# Altium project ROS_Motor-drive-control-panel.PrjPcb
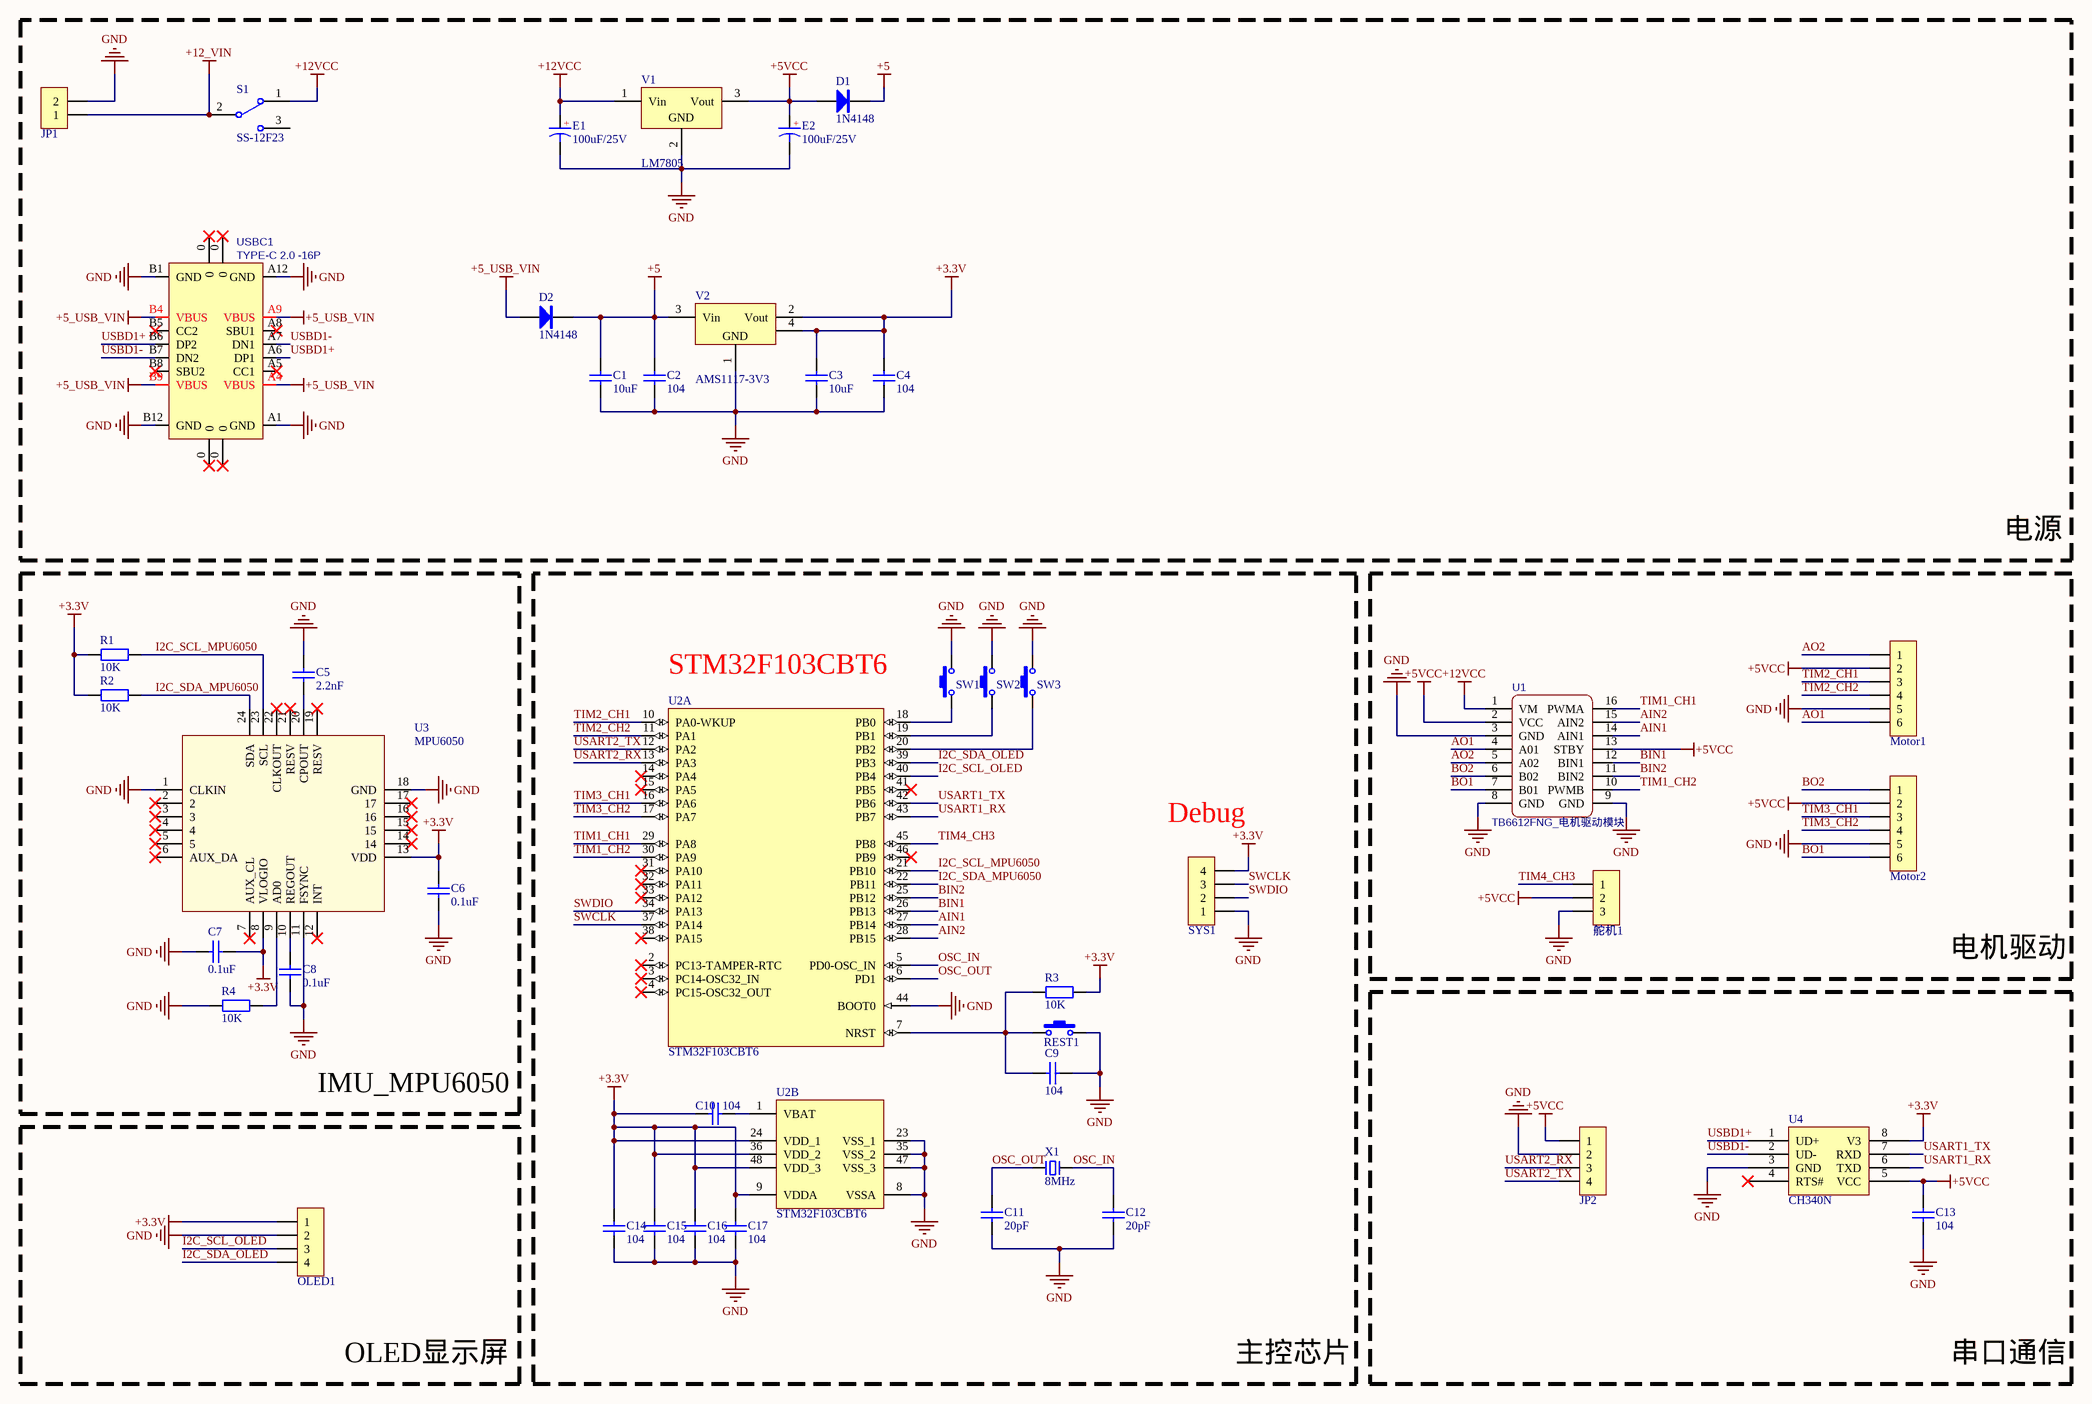
[diagram p0: main.SchDoc]
1 sheet, 45 parts. Net scope: global (net labels, ports and power ports of the same name join across sheets).
Board file: main.PcbDoc

## Sheet main.SchDoc
size A2; SheetNumber: 1; SheetTotal: 1

### Parts
C1  10uF  [C0805_L]
C2  104  [C0805_L]
C3  10uF  [C0805_L]
C4  104  [C0805_L]
C5  2.2nF  [C0805_L]
C6  0.1uF  [C0805_L]
C7  0.1uF  [C0805_L]
C8  0.1uF  [C0805_L]
C9  104  [C0805_L]
C10  104  [C0805_L]
C11  20pF  [C0805_L]
C12  20pF  [C0805_L]
C13  104  [C0805_L]
C14  104  [C0805_L]
C15  104  [C0805_L]
C16  104  [C0805_L]
C17  104  [C0805_L]
D1  1N4148  [MINI_MELF (LL34)]
D2  1N4148  [MINI_MELF (LL34)]
E1  100uF/25V  [CE D(6.3*7.7)]
E2  100uF/25V  [CE D(6.3*7.7)]
JP1  HDR-1X2  [KF350-2P]  (value not drawn)
JP2  HDR-1X4  [HDR2.54-LI-4P]  (value not drawn)
Motor1  HDR-1X6  [XH2.54-LI-6P]  (value not drawn)
Motor2  HDR-1X6  [XH2.54-LI-6P]  (value not drawn)
OLED1  HDR-1X4  [OLED-IIC-096]  (value not drawn)
R1  10K  [R0805_L]
R2  10K  [R0805_L]
R3  10K  [R0805_L]
R4  10K  [R0805_L]
REST1  3x6x5  [SW SMD-3*6*2.5]  (value not drawn)
S1  SS-12F23  [SS-12F23]
SW1  3x6x5  [SW SMD-3*6*2.5]  (value not drawn)
SW2  3x6x5  [SW SMD-3*6*2.5]  (value not drawn)
SW3  3x6x5  [SW SMD-3*6*2.5]  (value not drawn)
SYS1  HDR-1X4  [HDR2.54-LI-4P]  (value not drawn)
U1  TB6612FNG_电机驱动模块  [TP6612FNG]
U2  STM32F103CBT6  [STM-LQFP48_N]  (parts A,B of 2)
U3  MPU6050  [QFN24 4x4_M]
U4  CH340N  [SOIC-8]
USBC1  TYPE-C 2.0 -16P  [USB-C-SMD_16P]
V1  LM7805  [TO252]
V2  AMS1117-3V3  [SOT223_L]
X1  8MHz  [XTAL-5032-2P]
舵机1  HDR-1X3  [HDR2.54-LI-3P]  (value not drawn)

### Blocks framed on the sheet
电源: C1-C4 D1 D2 E1 E2 JP1 S1 USBC1 V1 V2
IMU_MPU6050: C5-C8 R1 R2 R4 U3
电机驱动: Motor1 Motor2 U1 舵机1
串口通信: C13 JP2 U4
OLED显示屏: OLED1

### Nets
+3.3V: C3.2 C4.2 C6.2 C7.2 C10.1 C14.2 C15.2 C16.2 C17.2 OLED1.1 R1.2 R2.2 R3.2 SYS1.4 U2.9(VDDA) U2.24(VDD_1) U2.36(VDD_2) U2.48(VDD_3) U3.8(VLOGIO) U3.13(VDD) U4.8(V3) V2.2(Vout) V2.4(GND)
+5: C1.2 C2.2 D1.2(K) D2.2(K) V2.3(Vin)
+5_USB_VIN: D2.1(A) USBC1.A4(VBUS) USBC1.A9(VBUS) USBC1.B4(VBUS) USBC1.B9(VBUS)
+5VCC: C13.2 D1.1(A) E2.1 JP2.1 Motor1.2 Motor2.2 U1.2(VCC) U1.13(STBY) U4.5(VCC) V1.3(Vout) 舵机1.2
+12_VIN: JP1.1 S1.2
+12VCC: E1.1 S1.1 U1.1(VM) V1.1(Vin)
GND: C1.1 C2.1 C3.1 C4.1 C5.2 C6.1 C7.1 C8.1 C9.2 C11.1 C12.1 C13.1 C14.1 C15.1 C16.1 C17.1 E1.2 E2.2 JP1.2 JP2.2 Motor1.5 Motor2.5 OLED1.2 R4.1 REST1.2 SW1.2 SW2.2 SW3.2 SYS1.1 U1.3(GND) U1.8(GND) U1.9(GND) U2.8(VSSA) U2.23(VSS_1) U2.35(VSS_2) U2.44(BOOT0) U2.47(VSS_3) U3.1(CLKIN) U3.11(FSYNC) U3.18(GND) U4.3(GND) USBC1.A1(GND) USBC1.A12(GND) USBC1.B1(GND) USBC1.B12(GND) V1.2(GND) V2.1(GND) 舵机1.3
AIN1: U1.14(AIN1) U2.27(PB14)
AIN2: U1.15(AIN2) U2.28(PB15)
AO1: Motor1.6 U1.4(A01)
AO2: Motor1.1 U1.5(A02)
BIN1: U1.12(BIN1) U2.26(PB13)
BIN2: U1.11(BIN2) U2.25(PB12)
BO1: Motor2.6 U1.7(B01)
BO2: Motor2.1 U1.6(B02)
I2C_SCL_MPU6050: R1.1 U2.21(PB10) U3.23(SCL)
I2C_SCL_OLED: OLED1.3 U2.40(PB4)
I2C_SDA_MPU6050: R2.1 U2.22(PB11) U3.24(SDA)
I2C_SDA_OLED: OLED1.4 U2.39(PB3)
OSC_IN: C12.2 U2.5(PD0-OSC_IN) X1.2
OSC_OUT: C11.2 U2.6(PD1) X1.1
SWCLK: SYS1.3 U2.37(PA14)
SWDIO: SYS1.2 U2.34(PA13)
TIM1_CH1: U1.16(PWMA) U2.29(PA8)
TIM1_CH2: U1.10(PWMB) U2.30(PA9)
TIM2_CH1: Motor1.3 U2.10(PA0-WKUP)
TIM2_CH2: Motor1.4 U2.11(PA1)
TIM3_CH1: Motor2.3 U2.16(PA6)
TIM3_CH2: Motor2.4 U2.17(PA7)
TIM4_CH3: U2.45(PB8) 舵机1.1
USART1_RX: U2.43(PB7) U4.6(TXD)
USART1_TX: U2.42(PB6) U4.7(RXD)
USART2_RX: JP2.3 U2.13(PA3)
USART2_TX: JP2.4 U2.12(PA2)
USBD1+: U4.1(UD+) USBC1.A6(DP1) USBC1.B6(DP2)
USBD1-: U4.2(UD-) USBC1.A7(DN1) USBC1.B7(DN2)
NetC5_1: C5.1 U3.20(CPOUT)
NetC8_2: C8.2 U3.10(REGOUT)
NetC9_1: C9.1 R3.1 REST1.1 U2.7(NRST)
NetC10_2: C10.2 U2.1(VBAT)
NetR4_2: R4.2 U3.9(AD0)
NetSW1_1: SW1.1 U2.18(PB0)
NetSW2_1: SW2.1 U2.19(PB1)
NetSW3_1: SW3.1 U2.20(PB2)

Not connected (* = marked no-connect by the designer): S1 3; U2 2(PC13-TAMPER-RTC)* 3(PC14-OSC32_IN)* 4(PC15-OSC32_OUT)* 14(PA4)* 15(PA5)* 31(PA10)* 32(PA11)* 33(PA12)* 38(PA15)* 41(PB5)* 46(PB9)*; U3 2* 3* 4* 5* 6(AUX_DA)* 7(AUX_CL)* 12(INT)* 14* 15* 16* 17* 19(RESV)* 21(RESV)* 22(CLKOUT)*; U4 4(RTS#)*; USBC1 0* A5(CC1)* A8(SBU1)* B5(CC2)* B8(SBU2)*

### Notes on the sheet
- (near U2) STM32F103CBT6
- (near SYS1) Debug
- 主控芯片
- (in symbol CE_SMD) +

### Library data of the parts
C1-C17 = C: 贴片电容/MLCC电容; BOM名称: 无极性贴片电容; 联系卖家，免费查找封装: 唯一出售店铺网址https://shop463601444.taobao.com
D1 D2 = 1N4148: 开关二极管; BOM名称: 高速开关二极管; 以赠品形式获赠本封装库的买家，还可联系卖家免费指导AD软件使用: 封装库来自淘宝卖家ID：黄晶宝石
E1 E2 = CE_SMD: 贴片电解电容; 联系卖家，免费查找封装: 唯一出售店铺网址https://shop463601444.taobao.com; BOM名称: 贴片电解电容
JP1 = Header 2: 2P接插件; 联系卖家，免费技术支持: 唯一出售店铺网址https://shop463601444.taobao.com; BOM名称: 2P接插件
JP2 OLED1 SYS1 = Header 4: 4P接插件; 联系卖家，免费查找封装: 唯一出售店铺网址https://shop463601444.taobao.com; 封装库来自淘宝卖家ID:黄晶宝石: 其他店铺购入均为盗版假冒封装库，请立即申请退款，本店现金奖励20~200元; BOM名称: 4P接插件
Motor1 Motor2 = Header 6: 6P接插件; 联系卖家，免费查找封装: 唯一出售店铺网址https://shop463601444.taobao.com; 封装库来自淘宝卖家ID:黄晶宝石: 其他店铺购入均为盗版假冒封装库，请立即申请退款，本店现金奖励20~200元; BOM名称: 6P接插件
R1-R4 = R: 贴片电阻; 联系卖家，免费查找封装: 唯一出售店铺网址https://shop463601444.taobao.com; BOM名称: 贴片电阻
REST1 = SW 3x6: 3x6轻触开关; 联系卖家，免费查找封装: 唯一出售店铺网址https://shop463601444.taobao.com; 封装库来自淘宝卖家ID：黄晶宝石: 其他店铺购入的，请立即申请退款，本店现金奖励20~500元; BOM名称: 3x6轻触开关
S1 = SSW-1P: 1路波动开关; BOM名称: 波动开关; 联系卖家，免费查找封装: 唯一出售店铺网址https://shop463601444.taobao.com; 封装库来自淘宝卖家ID：黄晶宝石: 其他店铺购入的，请立即申请退款，本店现金奖励20~500元
SW1-SW3 = SW-PB: 微动开关; BOM名称: 3x6轻触开关; 联系卖家，免费查找封装: 唯一出售店铺网址https://shop463601444.taobao.com; 封装库来自淘宝卖家ID：黄晶宝石: 其他店铺购入的，请立即申请退款，本店现金奖励20~500元
U1 = TB6612FNG_电机驱动模块: Contributor: TanAifeng; spicePre: U; spiceSymbolName: TB6612FNG_电机驱动模块
U2 = STM32F103CBT6: STM32 ARM-based 32-bit MCU Performance Line with 128 kB Flash, 20 kB Internal RAM, -40 to +85癈 Temperature, 48-Pin LQFP, Tray; 联系卖家，免费查找封装: 唯一出售店铺网址https://shop463601444.taobao.com; DatasheetVersion: rev13.0, Apr-2011; PackageVersion: rev13, Apr-2011; PackageReference: LQFP48; PackageDescription: 48-Pin Low-Profile Quad Flat Pack, 7 x 7 mm Body, 0.5 mm Pitch (LQFP48); ComponentLink1Description: Manufacturer URL; ComponentLink1URL: http://www.st.com/; ComponentLink2Description: STM32F103 Datasheet; ComponentLink2URL: http://www.st.com/internet/com/TECHNICAL_RESOURCES/TECHNICAL_LITERATURE/DATASHEET/CD00161566.pdf; ComponentLink3Description: STM32 Family Web Page; ComponentLink3URL: www.st.com/stm32
U3 = MPU6050: 三轴加速度+三轴陀螺仪; 封装库来自淘宝卖家ID：黄晶宝石: 其他店铺购入均为盗版封装库，请立即申请退款，本店现金奖励20~500元; 联系卖家 免费查找封装: 唯一出售店铺网址https://shop463601444.taobao.com
USBC1 = USB2.0_Type-C_16Pin: USB2.0_Type-C_16Pin母座; 联系卖家 免费技术支持: 封装库来自淘宝卖家ID：黄晶宝石
V1 = 7805: 5V线性稳压芯片; 封装库来自淘宝卖家ID：黄晶宝石: 其他店铺购入的买家，请立即申请退款，本店现金奖励20~1000元; BOM名称: 5V线性稳压芯片
V2 = AMS1117: 三端稳压芯片; BOM名称: 稳压芯片; 封装库来自淘宝卖家ID：黄晶宝石: 其他店铺购入的买家，请立即申请退款，本店现金奖励20~1000元
X1 = XTAL-2P: 2脚无源晶振(谐振器）; 联系卖家，免费查找封装: 唯一出售店铺网址https://shop463601444.taobao.com; BOM名称: 2脚无源晶振(谐振器）
舵机1 = Header 3: 3P接插件; 联系卖家，免费查找封装: 唯一出售店铺网址https://shop463601444.taobao.com; 封装库来自淘宝卖家ID:黄晶宝石: 其他店铺购入均为盗版假冒封装库，请立即申请退款，本店现金奖励20~200元; BOM名称: 3P接插件